# EAGLE schematic protoBot (EAGLE 6.3)

## Sheet 1 of 5
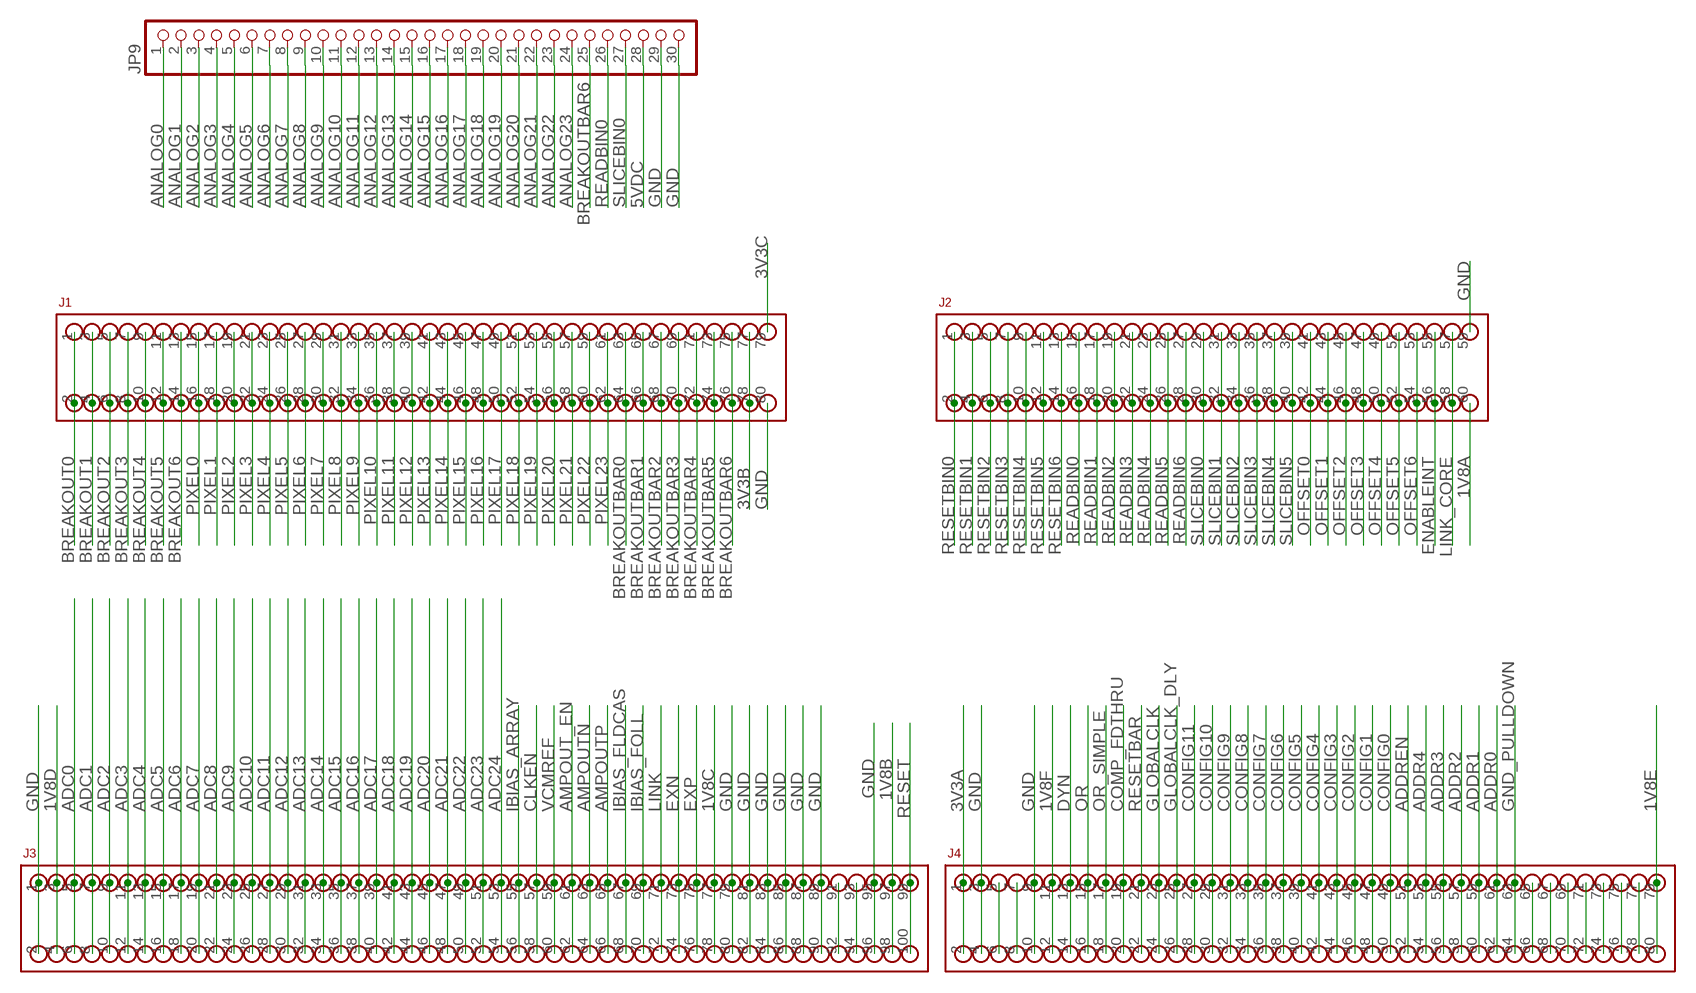
[diagram p0: schematic, sheet 1]

### Parts
J1  AMPMODU50-80  [AMPMODU50-80]
J2  AMPMODU50-60  [AMPMODU50-60]
J3  AMPMODU50-100  [AMPMODU50-100]
J4  AMPMODU50-80  [AMPMODU50-80]
JP9  PINHD-1X30  [1X30]

### Nets
1V8A: J2.60 ; also sheet 4,5
1V8B: J3.97 J3.98 ; also sheet 4,5
1V8C: J3.77 J3.78 ; also sheet 4,5
1V8D: J3.3 J3.4 ; also sheet 5
1V8E: J4.79 J4.80 ; also sheet 5
1V8F: J4.11 J4.12 ; also sheet 5
3V3A: J4.1 J4.2 ; also sheet 5
3V3B: J1.77 J1.78 ; also sheet 5
3V3C: J1.79 ; also sheet 3,5
5VDC: JP9.28 ; also sheet 2,5
ADC0: J3.5 J3.6 ; also sheet 4
ADC1: J3.7 J3.8 ; also sheet 4
ADC2: J3.9 J3.10 ; also sheet 4
ADC3: J3.11 J3.12 ; also sheet 4
ADC4: J3.13 J3.14 ; also sheet 4
ADC5: J3.15 J3.16 ; also sheet 4
ADC6: J3.17 J3.18 ; also sheet 4
ADC7: J3.19 J3.20 ; also sheet 4
ADC8: J3.21 J3.22 ; also sheet 4
ADC9: J3.23 J3.24 ; also sheet 4
ADC10: J3.25 J3.26 ; also sheet 4
ADC11: J3.27 J3.28 ; also sheet 4
ADC12: J3.29 J3.30 ; also sheet 4
ADC13: J3.31 J3.32 ; also sheet 4
ADC14: J3.33 J3.34 ; also sheet 4
ADC15: J3.35 J3.36 ; also sheet 4
ADC16: J3.37 J3.38 ; also sheet 4
ADC17: J3.39 J3.40 ; also sheet 4
ADC18: J3.41 J3.42 ; also sheet 4
ADC19: J3.43 J3.44 ; also sheet 4
ADC20: J3.45 J3.46 ; also sheet 4
ADC21: J3.47 J3.48 ; also sheet 4
ADC22: J3.49 J3.50 ; also sheet 4
ADC23: J3.51 J3.52 ; also sheet 4
ADC24: J3.53 J3.54 ; also sheet 4
ADDR0: J4.61 J4.62 ; also sheet 4
ADDR1: J4.59 J4.60 ; also sheet 4
ADDR2: J4.57 J4.58 ; also sheet 4
ADDR3: J4.55 J4.56 ; also sheet 4
ADDR4: J4.53 J4.54 ; also sheet 4
ADDREN: J4.51 J4.52 ; also sheet 4
AMPOUT_EN: J3.61 J3.62 ; also sheet 4
AMPOUTN: J3.63 J3.64 ; also sheet 4
AMPOUTP: J3.65 J3.66 ; also sheet 4
ANALOG0: JP9.1 ; also sheet 2
ANALOG1: JP9.2 ; also sheet 2
ANALOG2: JP9.3 ; also sheet 2
ANALOG3: JP9.4 ; also sheet 2
ANALOG4: JP9.5 ; also sheet 2
ANALOG5: JP9.6 ; also sheet 2
ANALOG6: JP9.7 ; also sheet 2
ANALOG7: JP9.8 ; also sheet 2
ANALOG8: JP9.9 ; also sheet 2
ANALOG9: JP9.10 ; also sheet 2
ANALOG10: JP9.11 ; also sheet 2
ANALOG11: JP9.12 ; also sheet 2
ANALOG12: JP9.13 ; also sheet 2
ANALOG13: JP9.14 ; also sheet 2
ANALOG14: JP9.15 ; also sheet 2
ANALOG15: JP9.16 ; also sheet 2
ANALOG16: JP9.17 ; also sheet 2
ANALOG17: JP9.18 ; also sheet 2
ANALOG18: JP9.19 ; also sheet 2
ANALOG19: JP9.20 ; also sheet 2
ANALOG20: JP9.21 ; also sheet 2
ANALOG21: JP9.22 ; also sheet 2
ANALOG22: JP9.23 ; also sheet 2
ANALOG23: JP9.24 ; also sheet 2
BREAKOUT0: J1.1 J1.2 ; also sheet 3
BREAKOUT1: J1.3 J1.4 ; also sheet 3
BREAKOUT2: J1.5 J1.6 ; also sheet 3
BREAKOUT3: J1.7 J1.8 ; also sheet 3
BREAKOUT4: J1.9 J1.10 ; also sheet 3
BREAKOUT5: J1.11 J1.12 ; also sheet 3
BREAKOUT6: J1.13 J1.14 ; also sheet 3
BREAKOUTBAR0: J1.63 J1.64 ; also sheet 3
BREAKOUTBAR1: J1.65 J1.66 ; also sheet 3
BREAKOUTBAR2: J1.67 J1.68 ; also sheet 3
BREAKOUTBAR3: J1.69 J1.70 ; also sheet 3
BREAKOUTBAR4: J1.71 J1.72 ; also sheet 3
BREAKOUTBAR5: J1.73 J1.74 ; also sheet 3
BREAKOUTBAR6: J1.75 J1.76 JP9.25 ; also sheet 3
CLKEN: J3.57 J3.58 ; also sheet 4
COMP_FDTHRU: J4.19 J4.20 ; also sheet 4
CONFIG0: J4.49 J4.50 ; also sheet 4
CONFIG1: J4.47 J4.48 ; also sheet 4
CONFIG2: J4.45 J4.46 ; also sheet 4
CONFIG3: J4.43 J4.44 ; also sheet 4
CONFIG4: J4.41 J4.42 ; also sheet 4
CONFIG5: J4.39 J4.40 ; also sheet 4
CONFIG6: J4.37 J4.38 ; also sheet 4
CONFIG7: J4.35 J4.36 ; also sheet 4
CONFIG8: J4.33 J4.34 ; also sheet 4
CONFIG9: J4.31 J4.32 ; also sheet 4
CONFIG10: J4.29 J4.30 ; also sheet 4
CONFIG11: J4.27 J4.28 ; also sheet 4
DYN: J4.13 J4.14
ENABLEINT: J2.55 J2.56 ; also sheet 4
EXN: J3.73 J3.74 ; also sheet 4
EXP: J3.75 J3.76 ; also sheet 4
GLOBALCLK: J4.23 J4.24
GLOBALCLK_DLY: J4.25 J4.26
GND: J1.80 J2.59 J3.1 J3.2 J3.79 J3.80 J3.81 J3.82 J3.83 J3.84 J3.85 J3.86 J3.87 J3.88 J3.89 J3.90 J3.95 J3.96 J4.3 J4.4 J4.9 J4.10 JP9.29 JP9.30 ; also sheet 2,3,4,5
GND_PULLDOWN: J4.63 J4.64 ; also sheet 4
IBIAS_ARRAY: J3.55 J3.56 ; also sheet 4
IBIAS_FLDCAS: J3.67 J3.68 ; also sheet 4
IBIAS_FOLL: J3.69 J3.70 ; also sheet 4
LINK: J3.71 J3.72 ; also sheet 4
LINK_CORE: J2.57 J2.58 ; also sheet 4
N$2: J4.5 J4.6
N$5: J4.7 J4.8
N$19: J4.65 J4.66
N$20: J4.67 J4.68
N$21: J4.69 J4.70
N$22: J4.71 J4.72
N$23: J4.73 J4.74
N$24: J4.75 J4.76
N$25: J4.77 J4.78
N$30: J3.91 J3.92
N$31: J3.93 J3.94
OFFSET0: J2.41 J2.42 ; also sheet 4
OFFSET1: J2.43 J2.44 ; also sheet 4
OFFSET2: J2.45 J2.46 ; also sheet 4
OFFSET3: J2.47 J2.48 ; also sheet 4
OFFSET4: J2.49 J2.50 ; also sheet 4
OFFSET5: J2.51 J2.52 ; also sheet 4
OFFSET6: J2.53 J2.54 ; also sheet 4
OR: J4.15 J4.16 ; also sheet 4
OR_SIMPLE: J4.17 J4.18 ; also sheet 4
PIXEL0: J1.15 J1.16 ; also sheet 2
PIXEL1: J1.17 J1.18 ; also sheet 2
PIXEL2: J1.19 J1.20 ; also sheet 2
PIXEL3: J1.21 J1.22 ; also sheet 2
PIXEL4: J1.23 J1.24 ; also sheet 2
PIXEL5: J1.25 J1.26 ; also sheet 2
PIXEL6: J1.27 J1.28 ; also sheet 2
PIXEL7: J1.29 J1.30 ; also sheet 2
PIXEL8: J1.31 J1.32 ; also sheet 2
PIXEL9: J1.33 J1.34 ; also sheet 2
PIXEL10: J1.35 J1.36 ; also sheet 2
PIXEL11: J1.37 J1.38 ; also sheet 2
PIXEL12: J1.39 J1.40 ; also sheet 2
PIXEL13: J1.41 J1.42 ; also sheet 2
PIXEL14: J1.43 J1.44 ; also sheet 2
PIXEL15: J1.45 J1.46 ; also sheet 2
PIXEL16: J1.47 J1.48 ; also sheet 2
PIXEL17: J1.49 J1.50 ; also sheet 2
PIXEL18: J1.51 J1.52 ; also sheet 2
PIXEL19: J1.53 J1.54 ; also sheet 2
PIXEL20: J1.55 J1.56 ; also sheet 2
PIXEL21: J1.57 J1.58 ; also sheet 2
PIXEL22: J1.59 J1.60 ; also sheet 2
PIXEL23: J1.61 J1.62 ; also sheet 2
READBIN0: J2.15 J2.16 JP9.26 ; also sheet 3
READBIN1: J2.17 J2.18
READBIN2: J2.19 J2.20
READBIN3: J2.21 J2.22
READBIN4: J2.23 J2.24
READBIN5: J2.25 J2.26
READBIN6: J2.27 J2.28 ; also sheet 3
RESET: J3.99 J3.100 ; also sheet 4
RESETBAR: J4.21 J4.22
RESETBIN0: J2.1 J2.2
RESETBIN1: J2.3 J2.4
RESETBIN2: J2.5 J2.6
RESETBIN3: J2.7 J2.8
RESETBIN4: J2.9 J2.10
RESETBIN5: J2.11 J2.12
RESETBIN6: J2.13 J2.14
SLICEBIN0: J2.29 J2.30 JP9.27 ; also sheet 3
SLICEBIN1: J2.31 J2.32 ; also sheet 3
SLICEBIN2: J2.33 J2.34 ; also sheet 3
SLICEBIN3: J2.35 J2.36 ; also sheet 3
SLICEBIN4: J2.37 J2.38 ; also sheet 3
SLICEBIN5: J2.39 J2.40 ; also sheet 3
VCMREF: J3.59 J3.60 ; also sheet 4

## Sheet 2 of 5
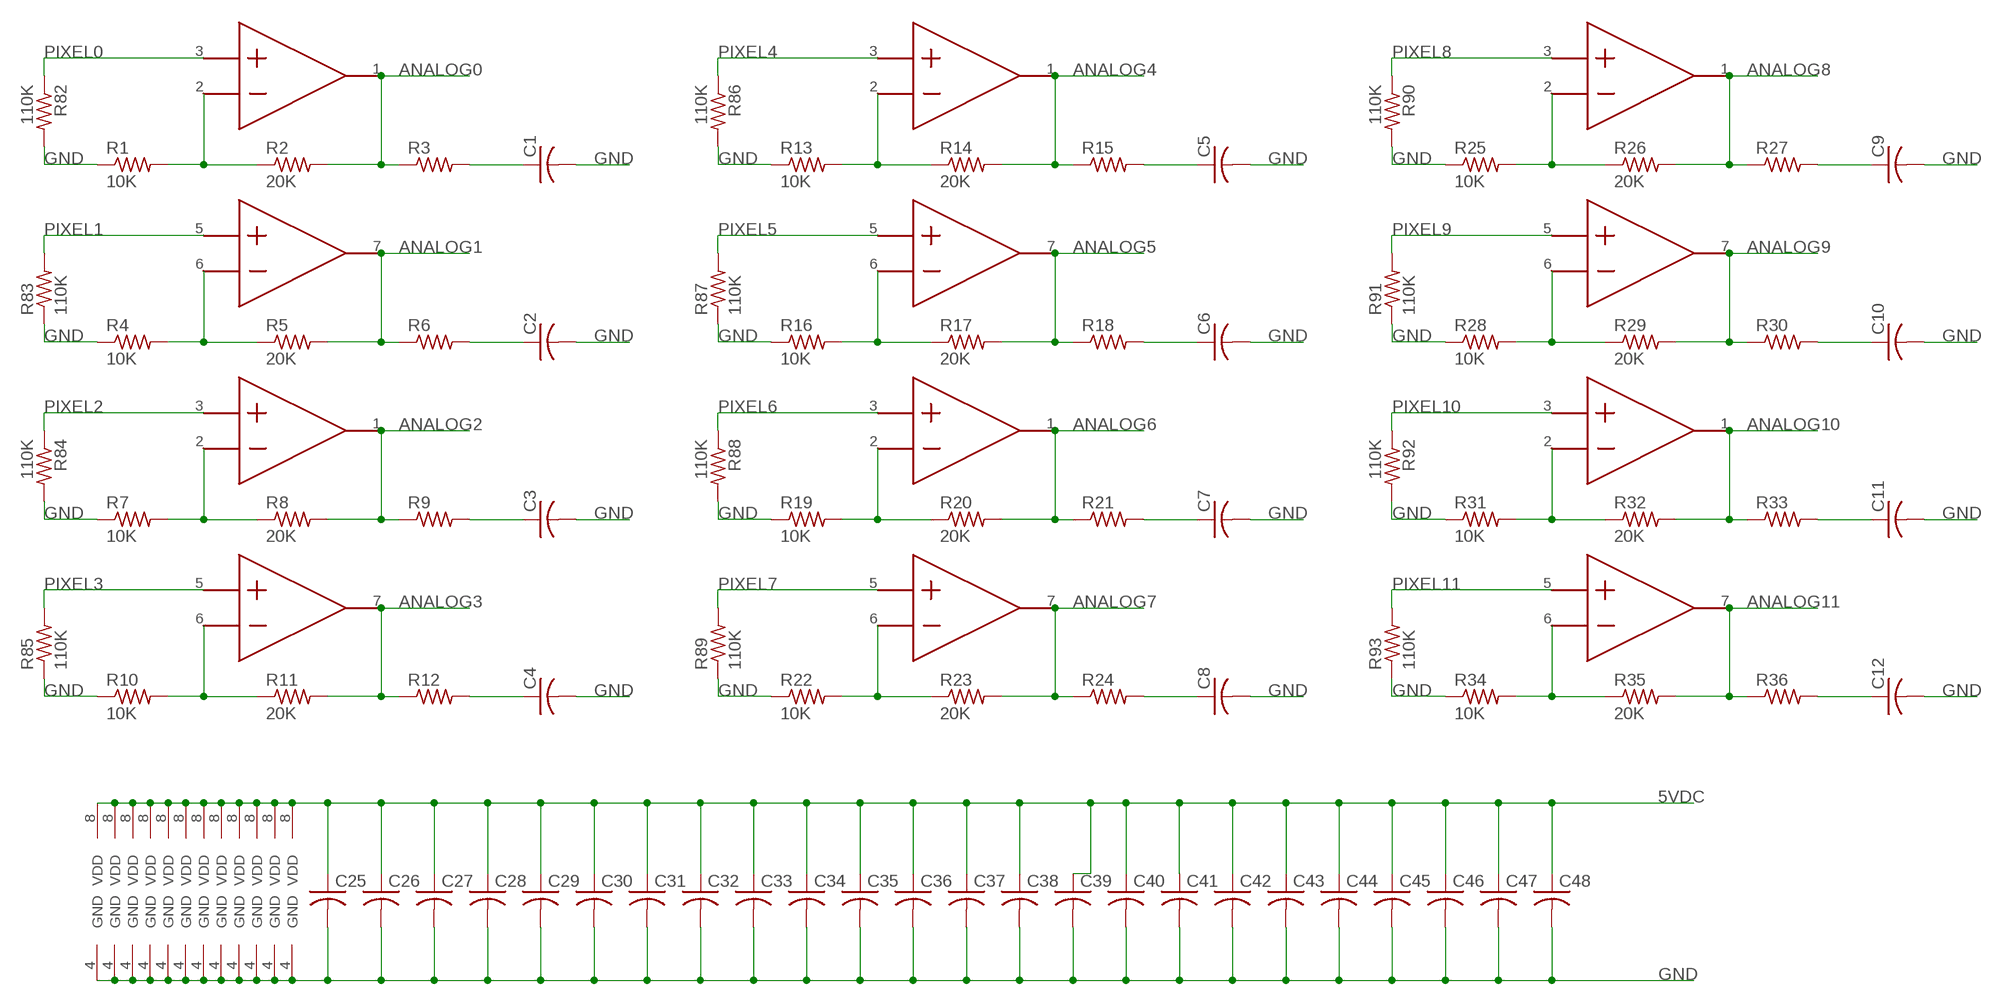
[diagram p1: schematic, sheet 2, part 1 of 2]
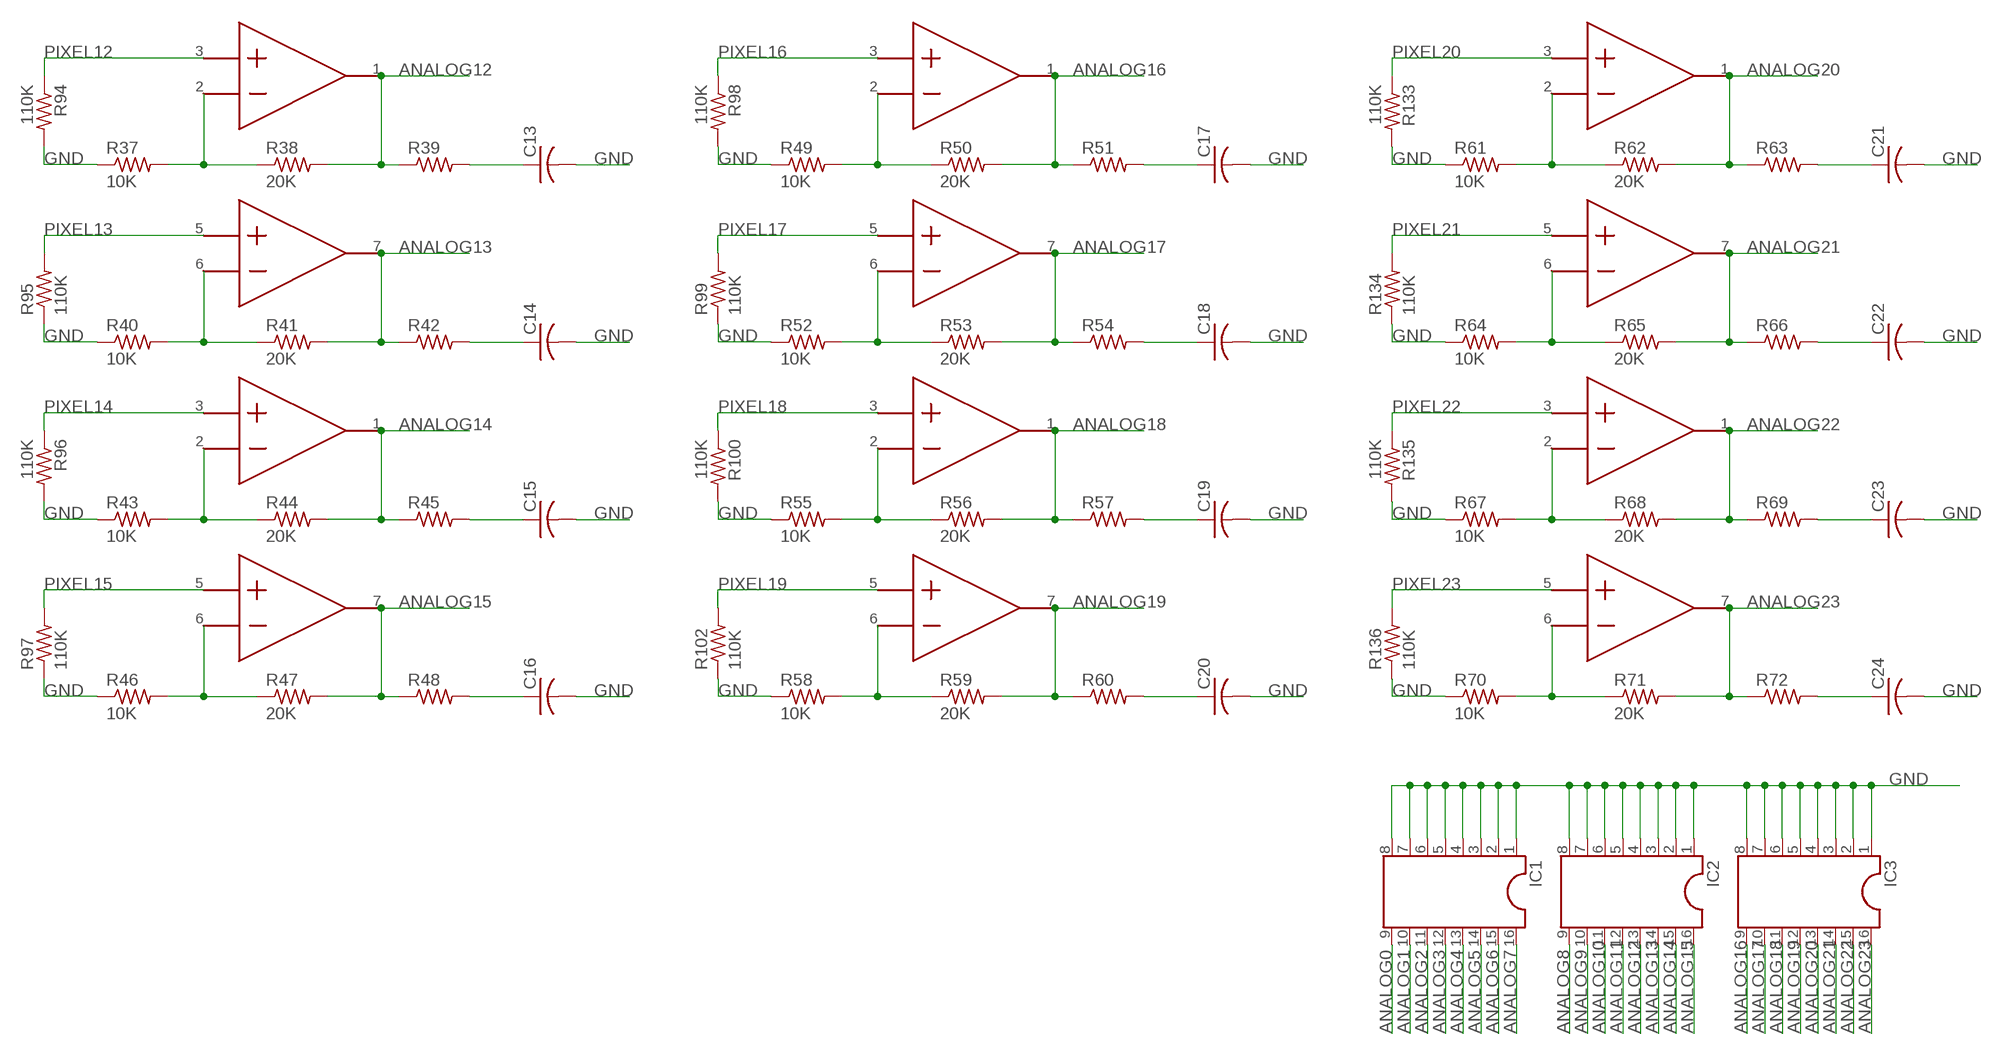
[diagram p2: schematic, sheet 2, part 2 of 2]

### Parts
C1  C-USC0603  [C0603]
C2  C-USC0603  [C0603]
C3  C-USC0603  [C0603]
C4  C-USC0603  [C0603]
C5  C-USC0603  [C0603]
C6  C-USC0603  [C0603]
C7  C-USC0603  [C0603]
C8  C-USC0603  [C0603]
C9  C-USC0603  [C0603]
C10  C-USC0603  [C0603]
C11  C-USC0603  [C0603]
C12  C-USC0603  [C0603]
C13  C-USC0603  [C0603]
C14  C-USC0603  [C0603]
C15  C-USC0603  [C0603]
C16  C-USC0603  [C0603]
C17  C-USC0603  [C0603]
C18  C-USC0603  [C0603]
C19  C-USC0603  [C0603]
C20  C-USC0603  [C0603]
C21  C-USC0603  [C0603]
C22  C-USC0603  [C0603]
C23  C-USC0603  [C0603]
C24  C-USC0603  [C0603]
C25  C-USC0603  [C0603]
C26  C-USC0603  [C0603]
C27  C-USC0603  [C0603]
C28  C-USC0603  [C0603]
C29  C-USC0603  [C0603]
C30  C-USC0603  [C0603]
C31  C-USC0603  [C0603]
C32  C-USC0603  [C0603]
C33  C-USC0603  [C0603]
C34  C-USC0603  [C0603]
C35  C-USC0603  [C0603]
C36  C-USC0603  [C0603]
C37  C-USC0603  [C0603]
C38  C-USC0603  [C0603]
C39  C-USC0603  [C0603]
C40  C-USC0603  [C0603]
C41  C-USC0603  [C0603]
C42  C-USC0603  [C0603]
C43  C-USC0603  [C0603]
C44  C-USC0603  [C0603]
C45  C-USC0603  [C0603]
C46  C-USC0603  [C0603]
C47  C-USC0603  [C0603]
C48  C-USC0603  [C0603]
IC1  DIL16S  [SOCKET-16]
IC2  DIL16S  [SOCKET-16]
IC3  DIL16S  [SOCKET-16]
R1  10K  R-US_R0603  [R0603]
R2  20K  R-US_R0603  [R0603]
R3  R-US_R0603  [R0603]
R4  10K  R-US_R0603  [R0603]
R5  20K  R-US_R0603  [R0603]
R6  R-US_R0603  [R0603]
R7  10K  R-US_R0603  [R0603]
R8  20K  R-US_R0603  [R0603]
R9  R-US_R0603  [R0603]
R10  10K  R-US_R0603  [R0603]
R11  20K  R-US_R0603  [R0603]
R12  R-US_R0603  [R0603]
R13  10K  R-US_R0603  [R0603]
R14  20K  R-US_R0603  [R0603]
R15  R-US_R0603  [R0603]
R16  10K  R-US_R0603  [R0603]
R17  20K  R-US_R0603  [R0603]
R18  R-US_R0603  [R0603]
R19  10K  R-US_R0603  [R0603]
R20  20K  R-US_R0603  [R0603]
R21  R-US_R0603  [R0603]
R22  10K  R-US_R0603  [R0603]
R23  20K  R-US_R0603  [R0603]
R24  R-US_R0603  [R0603]
R25  10K  R-US_R0603  [R0603]
R26  20K  R-US_R0603  [R0603]
R27  R-US_R0603  [R0603]
R28  10K  R-US_R0603  [R0603]
R29  20K  R-US_R0603  [R0603]
R30  R-US_R0603  [R0603]
R31  10K  R-US_R0603  [R0603]
R32  20K  R-US_R0603  [R0603]
R33  R-US_R0603  [R0603]
R34  10K  R-US_R0603  [R0603]
R35  20K  R-US_R0603  [R0603]
R36  R-US_R0603  [R0603]
R37  10K  R-US_R0603  [R0603]
R38  20K  R-US_R0603  [R0603]
R39  R-US_R0603  [R0603]
R40  10K  R-US_R0603  [R0603]
R41  20K  R-US_R0603  [R0603]
R42  R-US_R0603  [R0603]
R43  10K  R-US_R0603  [R0603]
R44  20K  R-US_R0603  [R0603]
R45  R-US_R0603  [R0603]
R46  10K  R-US_R0603  [R0603]
R47  20K  R-US_R0603  [R0603]
R48  R-US_R0603  [R0603]
R49  10K  R-US_R0603  [R0603]
R50  20K  R-US_R0603  [R0603]
R51  R-US_R0603  [R0603]
R52  10K  R-US_R0603  [R0603]
R53  20K  R-US_R0603  [R0603]
R54  R-US_R0603  [R0603]
R55  10K  R-US_R0603  [R0603]
R56  20K  R-US_R0603  [R0603]
R57  R-US_R0603  [R0603]
R58  10K  R-US_R0603  [R0603]
R59  20K  R-US_R0603  [R0603]
R60  R-US_R0603  [R0603]
R61  10K  R-US_R0603  [R0603]
R62  20K  R-US_R0603  [R0603]
R63  R-US_R0603  [R0603]
R64  10K  R-US_R0603  [R0603]
R65  20K  R-US_R0603  [R0603]
R66  R-US_R0603  [R0603]
R67  10K  R-US_R0603  [R0603]
R68  20K  R-US_R0603  [R0603]
R69  R-US_R0603  [R0603]
R70  10K  R-US_R0603  [R0603]
R71  20K  R-US_R0603  [R0603]
R72  R-US_R0603  [R0603]
R82  110K  R-US_R0603  [R0603]
R83  110K  R-US_R0603  [R0603]
R84  110K  R-US_R0603  [R0603]
R85  110K  R-US_R0603  [R0603]
R86  110K  R-US_R0603  [R0603]
R87  110K  R-US_R0603  [R0603]
R88  110K  R-US_R0603  [R0603]
R89  110K  R-US_R0603  [R0603]
R90  110K  R-US_R0603  [R0603]
R91  110K  R-US_R0603  [R0603]
R92  110K  R-US_R0603  [R0603]
R93  110K  R-US_R0603  [R0603]
R94  110K  R-US_R0603  [R0603]
R95  110K  R-US_R0603  [R0603]
R96  110K  R-US_R0603  [R0603]
R97  110K  R-US_R0603  [R0603]
R98  110K  R-US_R0603  [R0603]
R99  110K  R-US_R0603  [R0603]
R100  110K  R-US_R0603  [R0603]
R102  110K  R-US_R0603  [R0603]
R133  110K  R-US_R0603  [R0603]
R134  110K  R-US_R0603  [R0603]
R135  110K  R-US_R0603  [R0603]
R136  110K  R-US_R0603  [R0603]
U$1  AD823  [SOIC-8]
U$2  AD823  [SOIC-8]
U$3  AD823  [SOIC-8]
U$4  AD823  [SOIC-8]
U$5  AD823  [SOIC-8]
U$6  AD823  [SOIC-8]
U$7  AD823  [SOIC-8]
U$8  AD823  [SOIC-8]
U$9  AD823  [SOIC-8]
U$10  AD823  [SOIC-8]
U$11  AD823  [SOIC-8]
U$12  AD823  [SOIC-8]

### Nets
5VDC: C25.1 C26.1 C27.1 C28.1 C29.1 C30.1 C31.1 C32.1 C33.1 C34.1 C35.1 C36.1 C37.1 C38.1 C39.1 C40.1 C41.1 C42.1 C43.1 C44.1 C45.1 C46.1 C47.1 C48.1 U$1.8(VDD) U$2.8(VDD) U$3.8(VDD) U$4.8(VDD) U$5.8(VDD) U$6.8(VDD) U$7.8(VDD) U$8.8(VDD) U$9.8(VDD) U$10.8(VDD) U$11.8(VDD) U$12.8(VDD) ; also sheet 1,5
ANALOG0: IC1.9 R2.2 R3.1 U$1.1(OUT) ; also sheet 1
ANALOG1: IC1.10 R5.2 R6.1 U$1.7(OUT) ; also sheet 1
ANALOG2: IC1.11 R8.2 R9.1 U$2.1(OUT) ; also sheet 1
ANALOG3: IC1.12 R11.2 R12.1 U$2.7(OUT) ; also sheet 1
ANALOG4: IC1.13 R14.2 R15.1 U$3.1(OUT) ; also sheet 1
ANALOG5: IC1.14 R17.2 R18.1 U$3.7(OUT) ; also sheet 1
ANALOG6: IC1.15 R20.2 R21.1 U$4.1(OUT) ; also sheet 1
ANALOG7: IC1.16 R23.2 R24.1 U$4.7(OUT) ; also sheet 1
ANALOG8: IC2.9 R26.2 R27.1 U$5.1(OUT) ; also sheet 1
ANALOG9: IC2.10 R29.2 R30.1 U$5.7(OUT) ; also sheet 1
ANALOG10: IC2.11 R32.2 R33.1 U$6.1(OUT) ; also sheet 1
ANALOG11: IC2.12 R35.2 R36.1 U$6.7(OUT) ; also sheet 1
ANALOG12: IC2.13 R38.2 R39.1 U$7.1(OUT) ; also sheet 1
ANALOG13: IC2.14 R41.2 R42.1 U$7.7(OUT) ; also sheet 1
ANALOG14: IC2.15 R44.2 R45.1 U$8.1(OUT) ; also sheet 1
ANALOG15: IC2.16 R47.2 R48.1 U$8.7(OUT) ; also sheet 1
ANALOG16: IC3.9 R50.2 R51.1 U$9.1(OUT) ; also sheet 1
ANALOG17: IC3.10 R53.2 R54.1 U$9.7(OUT) ; also sheet 1
ANALOG18: IC3.11 R56.2 R57.1 U$10.1(OUT) ; also sheet 1
ANALOG19: IC3.12 R59.2 R60.1 U$10.7(OUT) ; also sheet 1
ANALOG20: IC3.13 R62.2 R63.1 U$11.1(OUT) ; also sheet 1
ANALOG21: IC3.14 R65.2 R66.1 U$11.7(OUT) ; also sheet 1
ANALOG22: IC3.15 R68.2 R69.1 U$12.1(OUT) ; also sheet 1
ANALOG23: IC3.16 R71.2 R72.1 U$12.7(OUT) ; also sheet 1
GND: C1.2 C2.2 C3.2 C4.2 C5.2 C6.2 C7.2 C8.2 C9.2 C10.2 C11.2 C12.2 C13.2 C14.2 C15.2 C16.2 C17.2 C18.2 C19.2 C20.2 C21.2 C22.2 C23.2 C24.2 C25.2 C26.2 C27.2 C28.2 C29.2 C30.2 C31.2 C32.2 C33.2 C34.2 C35.2 C36.2 C37.2 C38.2 C39.2 C40.2 C41.2 C42.2 C43.2 C44.2 C45.2 C46.2 C47.2 C48.2 IC1.1 IC1.2 IC1.3 IC1.4 IC1.5 IC1.6 IC1.7 IC1.8 IC2.1 IC2.2 IC2.3 IC2.4 IC2.5 IC2.6 IC2.7 IC2.8 IC3.1 IC3.2 IC3.3 IC3.4 IC3.5 IC3.6 IC3.7 IC3.8 R1.1 R4.1 R7.1 R10.1 R13.1 R16.1 R19.1 R22.1 R25.1 R28.1 R31.1 R34.1 R37.1 R40.1 R43.1 R46.1 R49.1 R52.1 R55.1 R58.1 R61.1 R64.1 R67.1 R70.1 R82.2 R83.1 R84.2 R85.1 R86.2 R87.1 R88.2 R89.1 R90.2 R91.1 R92.2 R93.1 R94.2 R95.1 R96.2 R97.1 R98.2 R99.1 R100.2 R102.1 R133.2 R134.1 R135.2 R136.1 U$1.4(GND) U$2.4(GND) U$3.4(GND) U$4.4(GND) U$5.4(GND) U$6.4(GND) U$7.4(GND) U$8.4(GND) U$9.4(GND) U$10.4(GND) U$11.4(GND) U$12.4(GND) ; also sheet 1,3,4,5
N$1: R1.2 R2.1 U$1.2(IN-)
N$4: C1.1 R3.2
N$6: R13.2 R14.1 U$3.2(IN-)
N$8: C5.1 R15.2
N$9: R4.2 R5.1 U$1.6(IN-)
N$11: C2.1 R6.2
N$12: R16.2 R17.1 U$3.6(IN-)
N$14: R7.2 R8.1 U$2.2(IN-)
N$16: C3.1 R9.2
N$17: C6.1 R18.2
N$18: R19.2 R20.1 U$4.2(IN-)
N$26: R10.2 R11.1 U$2.6(IN-)
N$28: C4.1 R12.2
N$32: C7.1 R21.2
N$33: R22.2 R23.1 U$4.6(IN-)
N$35: C8.1 R24.2
N$36: R25.2 R26.1 U$5.2(IN-)
N$38: C9.1 R27.2
N$39: R28.2 R29.1 U$5.6(IN-)
N$41: C10.1 R30.2
N$42: R31.2 R32.1 U$6.2(IN-)
N$44: C11.1 R33.2
N$45: R34.2 R35.1 U$6.6(IN-)
N$47: C12.1 R36.2
N$48: R37.2 R38.1 U$7.2(IN-)
N$50: C13.1 R39.2
N$51: R40.2 R41.1 U$7.6(IN-)
N$53: C14.1 R42.2
N$54: R43.2 R44.1 U$8.2(IN-)
N$56: C15.1 R45.2
N$57: R46.2 R47.1 U$8.6(IN-)
N$59: C16.1 R48.2
N$60: R49.2 R50.1 U$9.2(IN-)
N$62: C17.1 R51.2
N$63: R52.2 R53.1 U$9.6(IN-)
N$65: C18.1 R54.2
N$66: R55.2 R56.1 U$10.2(IN-)
N$68: C19.1 R57.2
N$69: R58.2 R59.1 U$10.6(IN-)
N$71: C20.1 R60.2
N$72: R61.2 R62.1 U$11.2(IN-)
N$74: C21.1 R63.2
N$75: R64.2 R65.1 U$11.6(IN-)
N$77: C22.1 R66.2
N$78: R67.2 R68.1 U$12.2(IN-)
N$80: C23.1 R69.2
N$81: R70.2 R71.1 U$12.6(IN-)
N$83: C24.1 R72.2
PIXEL0: R82.1 U$1.3(IN+) ; also sheet 1
PIXEL1: R83.2 U$1.5(IN+) ; also sheet 1
PIXEL2: R84.1 U$2.3(IN+) ; also sheet 1
PIXEL3: R85.2 U$2.5(IN+) ; also sheet 1
PIXEL4: R86.1 U$3.3(IN+) ; also sheet 1
PIXEL5: R87.2 U$3.5(IN+) ; also sheet 1
PIXEL6: R88.1 U$4.3(IN+) ; also sheet 1
PIXEL7: R89.2 U$4.5(IN+) ; also sheet 1
PIXEL8: R90.1 U$5.3(IN+) ; also sheet 1
PIXEL9: R91.2 U$5.5(IN+) ; also sheet 1
PIXEL10: R92.1 U$6.3(IN+) ; also sheet 1
PIXEL11: R93.2 U$6.5(IN+) ; also sheet 1
PIXEL12: R94.1 U$7.3(IN+) ; also sheet 1
PIXEL13: R95.2 U$7.5(IN+) ; also sheet 1
PIXEL14: R96.1 U$8.3(IN+) ; also sheet 1
PIXEL15: R97.2 U$8.5(IN+) ; also sheet 1
PIXEL16: R98.1 U$9.3(IN+) ; also sheet 1
PIXEL17: R99.2 U$9.5(IN+) ; also sheet 1
PIXEL18: R100.1 U$10.3(IN+) ; also sheet 1
PIXEL19: R102.2 U$10.5(IN+) ; also sheet 1
PIXEL20: R133.1 U$11.3(IN+) ; also sheet 1
PIXEL21: R134.2 U$11.5(IN+) ; also sheet 1
PIXEL22: R135.1 U$12.3(IN+) ; also sheet 1
PIXEL23: R136.2 U$12.5(IN+) ; also sheet 1

## Sheet 3 of 5
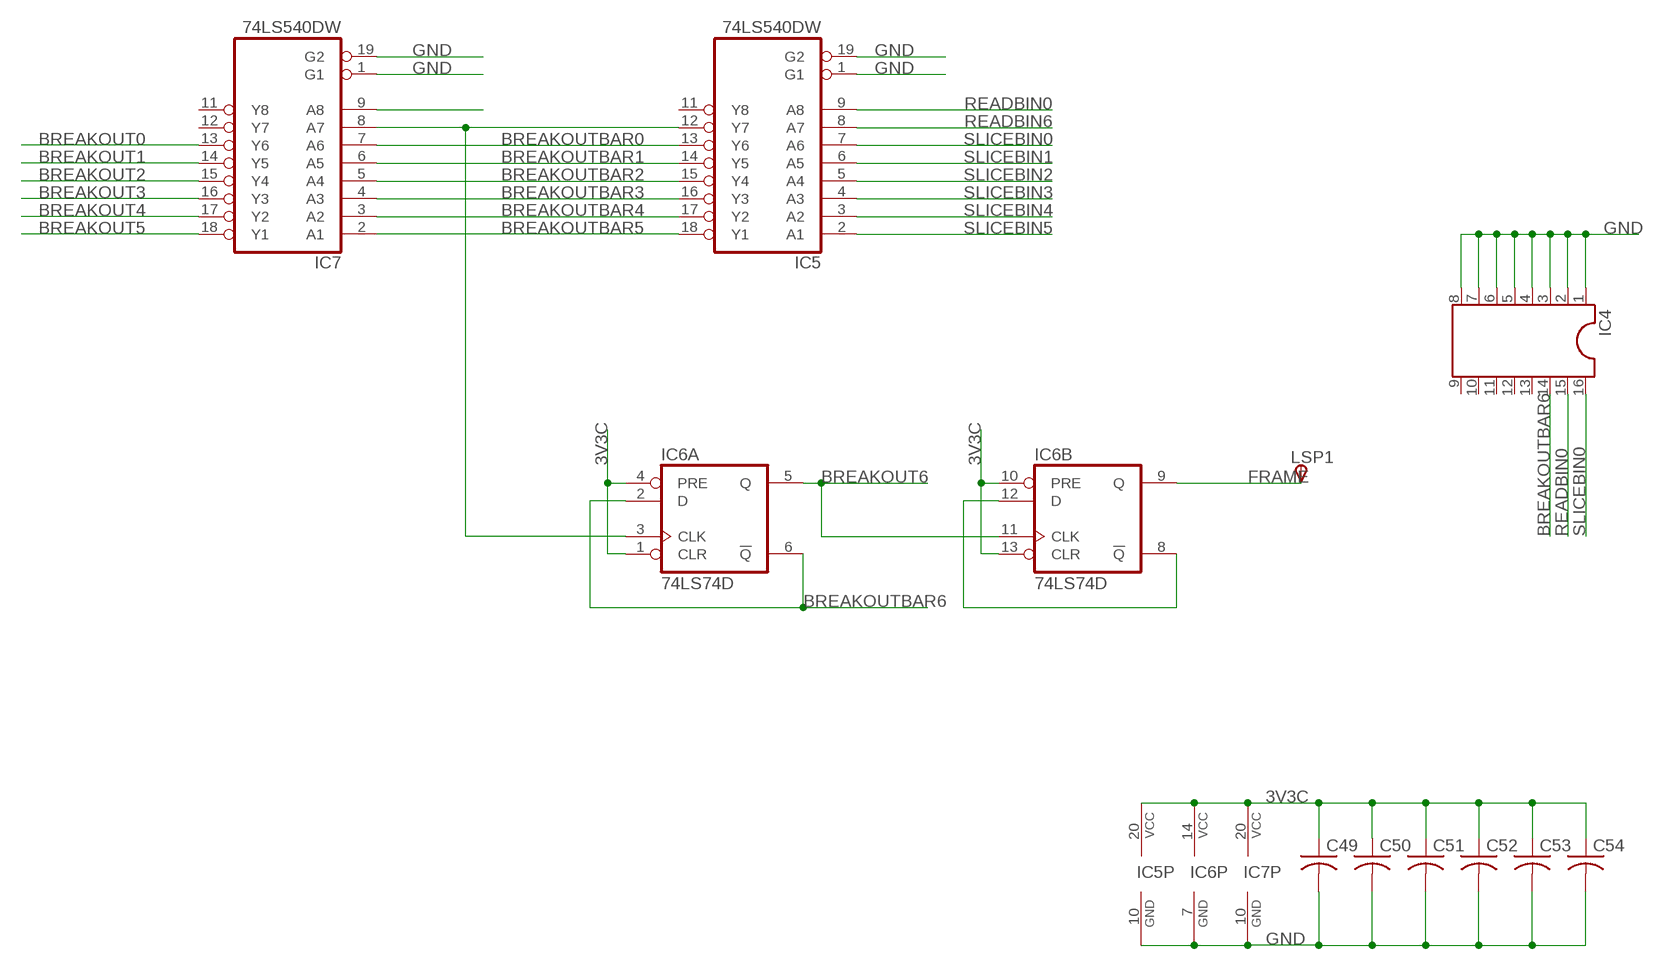
[diagram p3: schematic, sheet 3]

### Parts
C49  C-USC0603  [C0603]
C50  C-USC0603  [C0603]
C51  C-USC0603  [C0603]
C52  C-USC0603  [C0603]
C53  C-USC0603  [C0603]
C54  C-USC0603  [C0603]
IC4  DIL16S  [SOCKET-16]
IC5  74LS540DW  [SO20W]
IC6  74LS74D  [SO14]
IC7  74LS540DW  [SO20W]
LSP1  TPSPAD1-13  [P1-13]

### Nets
3V3C: C49.1 C50.1 C51.1 C52.1 C53.1 C54.1 IC5.20(VCC) IC6.1(A:CLR) IC6.4(A:PRE) IC6.10(B:PRE) IC6.13(B:CLR) IC6.14(P:VCC) IC7.20(VCC) ; also sheet 1,5
BREAKOUT0: IC7.13(Y6) ; also sheet 1
BREAKOUT1: IC7.14(Y5) ; also sheet 1
BREAKOUT2: IC7.15(Y4) ; also sheet 1
BREAKOUT3: IC7.16(Y3) ; also sheet 1
BREAKOUT4: IC7.17(Y2) ; also sheet 1
BREAKOUT5: IC7.18(Y1) ; also sheet 1
BREAKOUT6: IC6.5(A:Q) IC6.11(B:CLK) ; also sheet 1
BREAKOUTBAR0: IC5.13(Y6) IC7.7(A6) ; also sheet 1
BREAKOUTBAR1: IC5.14(Y5) IC7.6(A5) ; also sheet 1
BREAKOUTBAR2: IC5.15(Y4) IC7.5(A4) ; also sheet 1
BREAKOUTBAR3: IC5.16(Y3) IC7.4(A3) ; also sheet 1
BREAKOUTBAR4: IC5.17(Y2) IC7.3(A2) ; also sheet 1
BREAKOUTBAR5: IC5.18(Y1) IC7.2(A1) ; also sheet 1
BREAKOUTBAR6: IC4.14 IC6.2(A:D) IC6.6(A:!Q) ; also sheet 1
FRAME: IC6.9(B:Q) LSP1.1(PP)
GND: C49.2 C50.2 C51.2 C52.2 C53.2 C54.2 IC4.1 IC4.2 IC4.3 IC4.4 IC4.5 IC4.6 IC4.7 IC4.8 IC5.1(G1) IC5.10(GND) IC5.19(G2) IC6.7(P:GND) IC7.1(G1) IC7.9(A8) IC7.10(GND) IC7.19(G2) ; also sheet 1,2,4,5
N$15: IC5.12(Y7) IC6.3(A:CLK) IC7.8(A7)
N$37: IC6.8(B:!Q) IC6.12(B:D)
READBIN0: IC4.15 IC5.9(A8) ; also sheet 1
READBIN6: IC5.8(A7) ; also sheet 1
SLICEBIN0: IC4.16 IC5.7(A6) ; also sheet 1
SLICEBIN1: IC5.6(A5) ; also sheet 1
SLICEBIN2: IC5.5(A4) ; also sheet 1
SLICEBIN3: IC5.4(A3) ; also sheet 1
SLICEBIN4: IC5.3(A2) ; also sheet 1
SLICEBIN5: IC5.2(A1) ; also sheet 1
Unconnected: IC4.9 IC4.10 IC4.11 IC4.12 IC4.13 IC5.11(Y8) IC7.11(Y8) IC7.12(Y7)

## Sheet 4 of 5
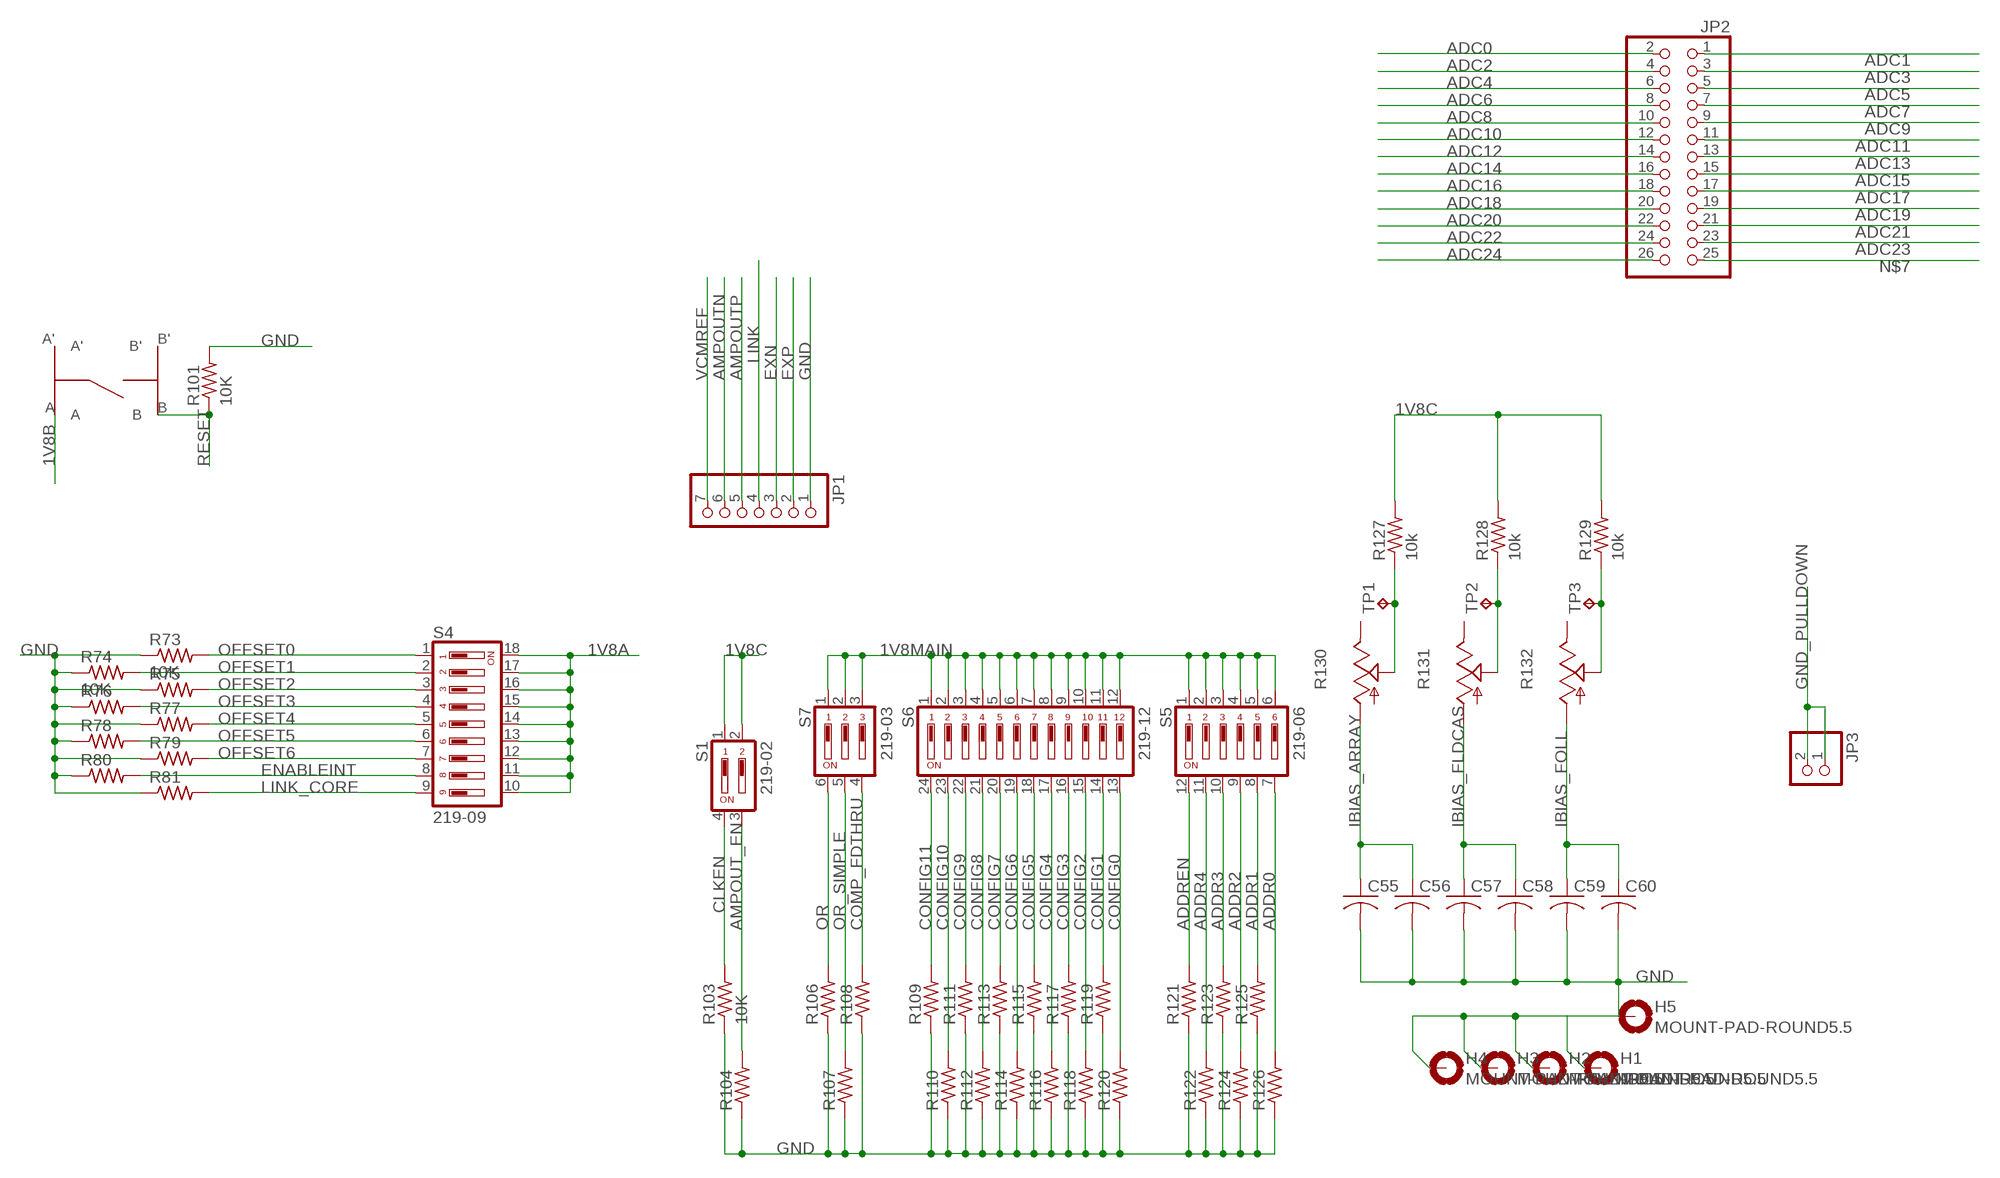
[diagram p4: schematic, sheet 4]

### Parts
C55  C-USC1210  [C1210]
C56  C-USC0603  [C0603]
C57  C-USC1210  [C1210]
C58  C-USC0603  [C0603]
C59  C-USC1210  [C1210]
C60  C-USC0603  [C0603]
H1  MOUNT-PAD-ROUND5.5  [5,5-PAD]
H2  MOUNT-PAD-ROUND5.5  [5,5-PAD]
H3  MOUNT-PAD-ROUND5.5  [5,5-PAD]
H4  MOUNT-PAD-ROUND5.5  [5,5-PAD]
H5  MOUNT-PAD-ROUND5.5  [5,5-PAD]
JP1  PINHD-1X7  [1X07]
JP2  PINHD-2X13  [2X13]
JP3  PINHD-1X2  [1X02]
R73  10K  R-US_R0603  [R0603]
R74  10K  R-US_R0603  [R0603]
R75  R-US_R0603  [R0603]
R76  R-US_R0603  [R0603]
R77  R-US_R0603  [R0603]
R78  R-US_R0603  [R0603]
R79  R-US_R0603  [R0603]
R80  R-US_R0603  [R0603]
R81  R-US_R0603  [R0603]
R101  10K  R-US_R0603  [R0603]
R103  10K  R-US_R0603  [R0603]
R104  R-US_R0603  [R0603]
R106  R-US_R0603  [R0603]
R107  R-US_R0603  [R0603]
R108  R-US_R0603  [R0603]
R109  R-US_R0603  [R0603]
R110  R-US_R0603  [R0603]
R111  R-US_R0603  [R0603]
R112  R-US_R0603  [R0603]
R113  R-US_R0603  [R0603]
R114  R-US_R0603  [R0603]
R115  R-US_R0603  [R0603]
R116  R-US_R0603  [R0603]
R117  R-US_R0603  [R0603]
R118  R-US_R0603  [R0603]
R119  R-US_R0603  [R0603]
R120  R-US_R0603  [R0603]
R121  R-US_R0603  [R0603]
R122  R-US_R0603  [R0603]
R123  R-US_R0603  [R0603]
R124  R-US_R0603  [R0603]
R125  R-US_R0603  [R0603]
R126  R-US_R0603  [R0603]
R127  10k  R-US_R0603  [R0603]
R128  10k  R-US_R0603  [R0603]
R129  10k  R-US_R0603  [R0603]
R130  TRIM_US-B64Y  [B64Y]
R131  TRIM_US-B64Y  [B64Y]
R132  TRIM_US-B64Y  [B64Y]
S1  219-02  [CTS-219-02]
S2  EVQPA  [EVQPA]
S4  219-09  [CTS-219-09]
S5  219-06  [CTS-219-06]
S6  219-12  [CTS-219-12]
S7  219-03  [CTS-219-03]
TP1  TPTP20R  [TP20R]
TP2  TPTP20R  [TP20R]
TP3  TPTP20R  [TP20R]

### Nets
1V8A: S4.10 S4.11 S4.12 S4.13 S4.14 S4.15 S4.16 S4.17 S4.18 ; also sheet 1,5
1V8B: S2.A ; also sheet 1,5
1V8C: R127.2 R128.2 R129.2 S1.1 S1.2 ; also sheet 1,5
1V8MAIN: S5.1 S5.2 S5.3 S5.4 S5.5 S5.6 S6.1 S6.2 S6.3 S6.4 S6.5 S6.6 S6.7 S6.8 S6.9 S6.10 S6.11 S6.12 S7.1 S7.2 S7.3 ; also sheet 5
ADC0: JP2.2 ; also sheet 1
ADC1: JP2.1 ; also sheet 1
ADC2: JP2.4 ; also sheet 1
ADC3: JP2.3 ; also sheet 1
ADC4: JP2.6 ; also sheet 1
ADC5: JP2.5 ; also sheet 1
ADC6: JP2.8 ; also sheet 1
ADC7: JP2.7 ; also sheet 1
ADC8: JP2.10 ; also sheet 1
ADC9: JP2.9 ; also sheet 1
ADC10: JP2.12 ; also sheet 1
ADC11: JP2.11 ; also sheet 1
ADC12: JP2.14 ; also sheet 1
ADC13: JP2.13 ; also sheet 1
ADC14: JP2.16 ; also sheet 1
ADC15: JP2.15 ; also sheet 1
ADC16: JP2.18 ; also sheet 1
ADC17: JP2.17 ; also sheet 1
ADC18: JP2.20 ; also sheet 1
ADC19: JP2.19 ; also sheet 1
ADC20: JP2.22 ; also sheet 1
ADC21: JP2.21 ; also sheet 1
ADC22: JP2.24 ; also sheet 1
ADC23: JP2.23 ; also sheet 1
ADC24: JP2.26 ; also sheet 1
ADDR0: R126.2 S5.7 ; also sheet 1
ADDR1: R125.2 S5.8 ; also sheet 1
ADDR2: R124.2 S5.9 ; also sheet 1
ADDR3: R123.2 S5.10 ; also sheet 1
ADDR4: R122.2 S5.11 ; also sheet 1
ADDREN: R121.2 S5.12 ; also sheet 1
AMPOUT_EN: R104.2 S1.3 ; also sheet 1
AMPOUTN: JP1.6 ; also sheet 1
AMPOUTP: JP1.5 ; also sheet 1
CLKEN: R103.2 S1.4 ; also sheet 1
COMP_FDTHRU: R108.2 S7.4 ; also sheet 1
CONFIG0: R120.2 S6.13 ; also sheet 1
CONFIG1: R119.2 S6.14 ; also sheet 1
CONFIG2: R118.2 S6.15 ; also sheet 1
CONFIG3: R117.2 S6.16 ; also sheet 1
CONFIG4: R116.2 S6.17 ; also sheet 1
CONFIG5: R115.2 S6.18 ; also sheet 1
CONFIG6: R114.2 S6.19 ; also sheet 1
CONFIG7: R113.2 S6.20 ; also sheet 1
CONFIG8: R112.2 S6.21 ; also sheet 1
CONFIG9: R111.2 S6.22 ; also sheet 1
CONFIG10: R110.2 S6.23 ; also sheet 1
CONFIG11: R109.2 S6.24 ; also sheet 1
ENABLEINT: R80.2 S4.8 ; also sheet 1
EXN: JP1.3 ; also sheet 1
EXP: JP1.2 ; also sheet 1
GND: C55.2 C56.2 C57.2 C58.2 C59.2 C60.2 H1.B5,5(MOUNT) H2.B5,5(MOUNT) H3.B5,5(MOUNT) H4.B5,5(MOUNT) H5.B5,5(MOUNT) JP1.1 R73.1 R74.1 R75.1 R76.1 R77.1 R78.1 R79.1 R80.1 R81.1 R101.2 R103.1 R104.1 R106.1 R107.1 R108.1 R109.1 R110.1 R111.1 R112.1 R113.1 R114.1 R115.1 R116.1 R117.1 R118.1 R119.1 R120.1 R121.1 R122.1 R123.1 R124.1 R125.1 R126.1 ; also sheet 1,2,3,5
GND_PULLDOWN: JP3.1 JP3.2 ; also sheet 1
IBIAS_ARRAY: C55.1 C56.1 R130.A ; also sheet 1
IBIAS_FLDCAS: C57.1 C58.1 R131.A ; also sheet 1
IBIAS_FOLL: C59.1 C60.1 R132.A ; also sheet 1
LINK: JP1.4 ; also sheet 1
LINK_CORE: R81.2 S4.9 ; also sheet 1
N$7: JP2.25
N$29: R127.1 R130.S TP1.TP
N$43: R128.1 R131.S TP2.TP
N$52: R129.1 R132.S TP3.TP
OFFSET0: R73.2 S4.1 ; also sheet 1
OFFSET1: R74.2 S4.2 ; also sheet 1
OFFSET2: R75.2 S4.3 ; also sheet 1
OFFSET3: R76.2 S4.4 ; also sheet 1
OFFSET4: R77.2 S4.5 ; also sheet 1
OFFSET5: R78.2 S4.6 ; also sheet 1
OFFSET6: R79.2 S4.7 ; also sheet 1
OR: R106.2 S7.6 ; also sheet 1
OR_SIMPLE: R107.2 S7.5 ; also sheet 1
RESET: R101.1 S2.B ; also sheet 1
VCMREF: JP1.7 ; also sheet 1
Unconnected: R130.E R131.E R132.E S2.A' S2.B'

## Sheet 5 of 5
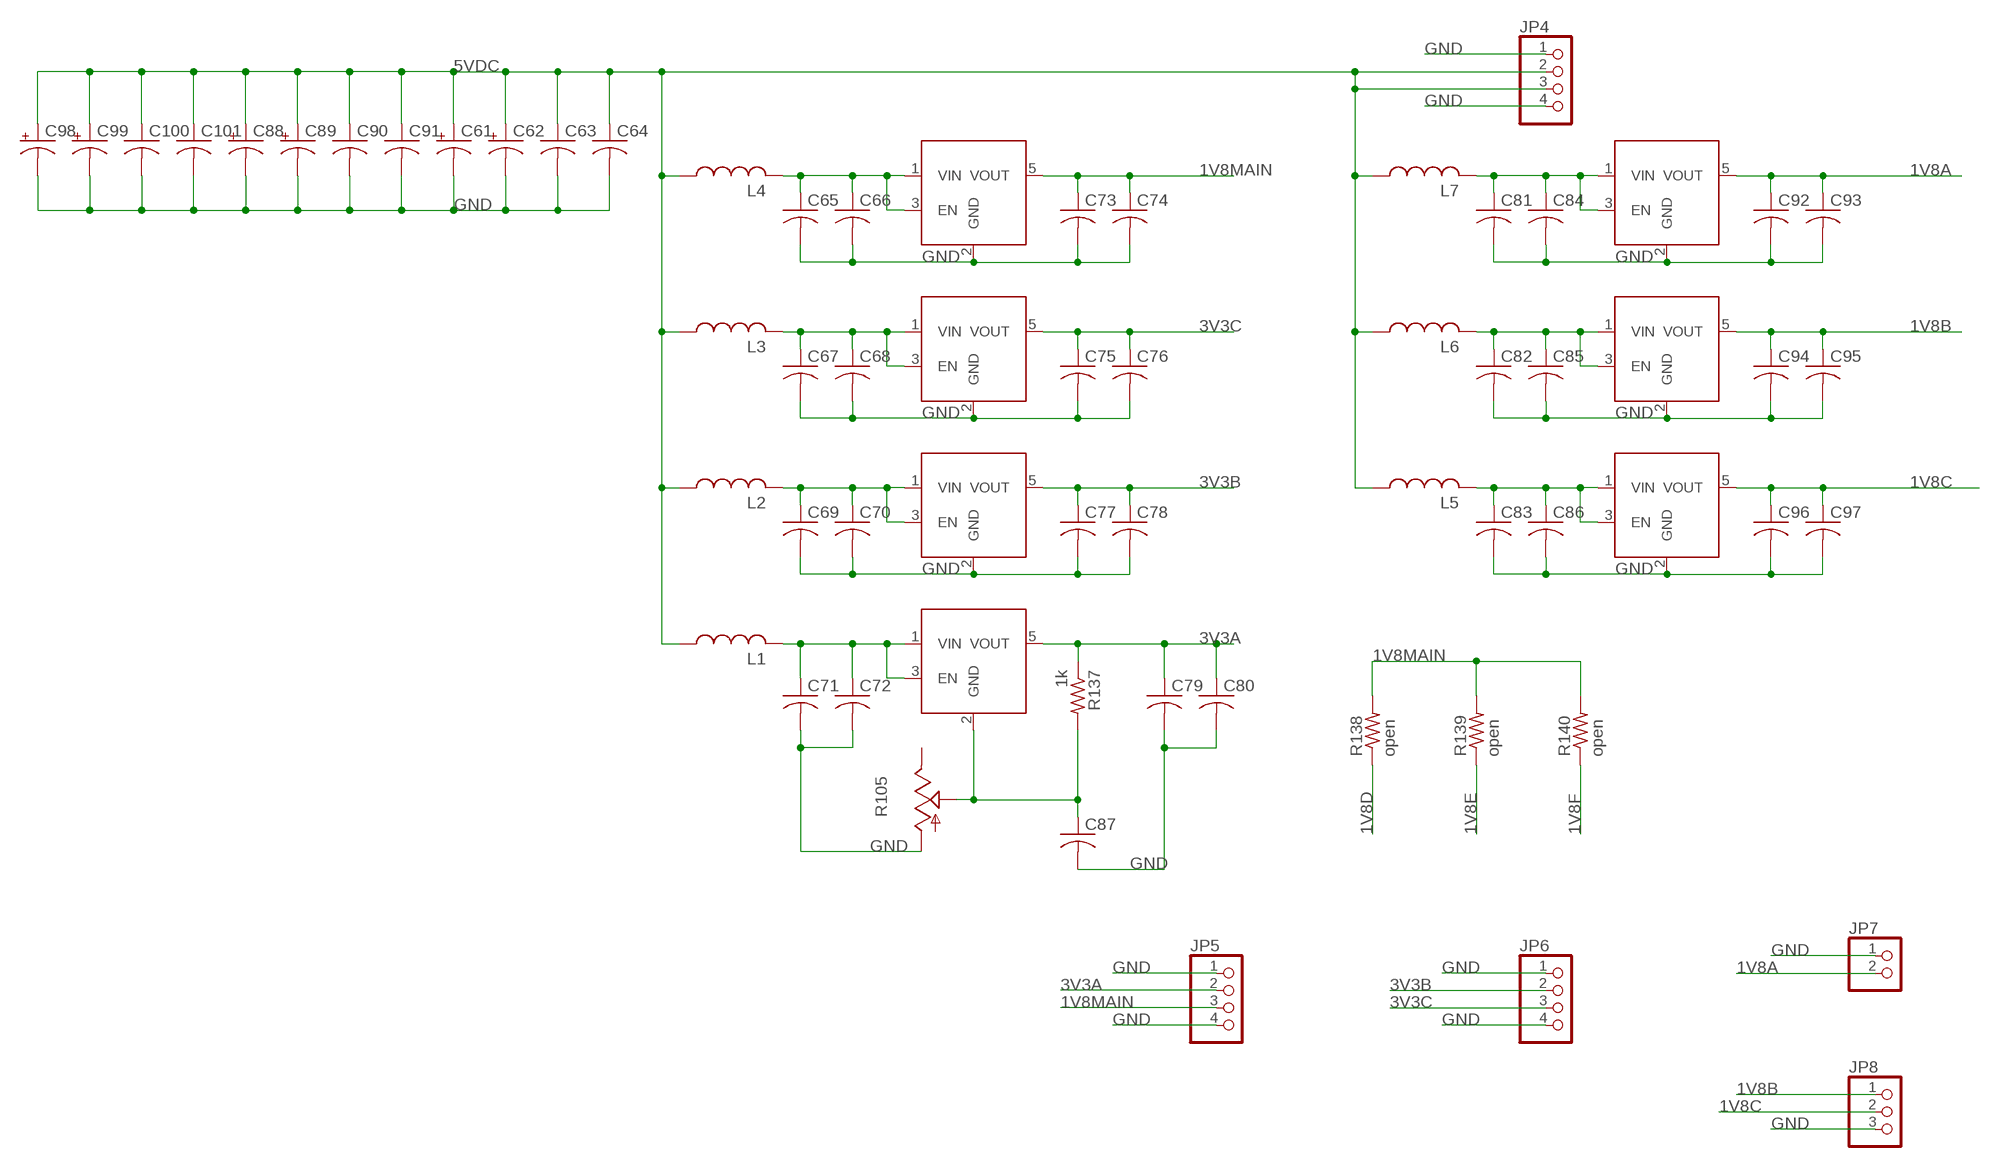
[diagram p5: schematic, sheet 5]

### Parts
C61  CPOL-USE/7260-38R  [E/7260-38R]
C62  CPOL-USE/7260-38R  [E/7260-38R]
C63  C-USC1210  [C1210]
C64  C-USC1210  [C1210]
C65  C-USC0603  [C0603]
C66  C-USC1210  [C1210]
C67  C-USC0603  [C0603]
C68  C-USC1210  [C1210]
C69  C-USC0603  [C0603]
C70  C-USC1210  [C1210]
C71  C-USC0603  [C0603]
C72  C-USC1210  [C1210]
C73  C-USC1210  [C1210]
C74  C-USC0603  [C0603]
C75  C-USC1210  [C1210]
C76  C-USC0603  [C0603]
C77  C-USC1210  [C1210]
C78  C-USC0603  [C0603]
C79  C-USC1210  [C1210]
C80  C-USC0603  [C0603]
C81  C-USC0603  [C0603]
C82  C-USC0603  [C0603]
C83  C-USC0603  [C0603]
C84  C-USC1210  [C1210]
C85  C-USC1210  [C1210]
C86  C-USC1210  [C1210]
C87  C-USC0603  [C0603]
C88  CPOL-USE/7260-38R  [E/7260-38R]
C89  CPOL-USE/7260-38R  [E/7260-38R]
C90  C-USC1210  [C1210]
C91  C-USC1210  [C1210]
C92  C-USC1210  [C1210]
C93  C-USC0603  [C0603]
C94  C-USC1210  [C1210]
C95  C-USC0603  [C0603]
C96  C-USC1210  [C1210]
C97  C-USC0603  [C0603]
C98  CPOL-USE/7260-38R  [E/7260-38R]
C99  CPOL-USE/7260-38R  [E/7260-38R]
C100  C-USC1210  [C1210]
C101  C-USC1210  [C1210]
JP4  PINHD-1X4  [1X04]
JP5  PINHD-1X4  [1X04]
JP6  PINHD-1X4  [1X04]
JP7  PINHD-1X2  [1X02]
JP8  PINHD-1X3  [1X03]
L1  L-USL1812  [L1812]
L2  L-USL1812  [L1812]
L3  L-USL1812  [L1812]
L4  L-USL1812  [L1812]
L5  L-USL1812  [L1812]
L6  L-USL1812  [L1812]
L7  L-USL1812  [L1812]
R105  TRIM_US-B64Y  [B64Y]
R137  1k  R-US_R0603  [R0603]
R138  open  R-US_R1206  [R1206]
R139  open  R-US_R1206  [R1206]
R140  open  R-US_R1206  [R1206]
U$13  ADP151  [TSOT23-5]
U$14  ADP151  [TSOT23-5]
U$15  ADP151  [TSOT23-5]
U$28  ADP151  [TSOT23-5]
U$29  ADP151  [TSOT23-5]
U$30  ADP151  [TSOT23-5]
U$31  ADP151  [TSOT23-5]

### Nets
1V8A: C92.1 C93.1 JP7.2 U$13.5(VOUT) ; also sheet 1,4
1V8B: C94.1 C95.1 JP8.1 U$14.5(VOUT) ; also sheet 1,4
1V8C: C96.1 C97.1 JP8.2 U$15.5(VOUT) ; also sheet 1,4
1V8D: R138.1 ; also sheet 1
1V8E: R139.1 ; also sheet 1
1V8F: R140.1 ; also sheet 1
1V8MAIN: C73.1 C74.1 JP5.3 R138.2 R139.2 R140.2 U$28.5(VOUT) ; also sheet 4
3V3A: C79.1 C80.1 JP5.2 R137.1 U$31.5(VOUT) ; also sheet 1
3V3B: C77.1 C78.1 JP6.2 U$30.5(VOUT) ; also sheet 1
3V3C: C75.1 C76.1 JP6.3 U$29.5(VOUT) ; also sheet 1,3
5VDC: C61.+ C62.+ C63.1 C64.1 C88.+ C89.+ C90.1 C91.1 C98.+ C99.+ C100.1 C101.1 JP4.2 JP4.3 L1.1 L2.1 L3.1 L4.1 L5.1 L6.1 L7.1 ; also sheet 1,2
GND: C61.- C62.- C63.2 C64.2 C65.2 C66.2 C67.2 C68.2 C69.2 C70.2 C71.2 C72.2 C73.2 C74.2 C75.2 C76.2 C77.2 C78.2 C79.2 C80.2 C81.2 C82.2 C83.2 C84.2 C85.2 C86.2 C87.2 C88.- C89.- C90.2 C91.2 C92.2 C93.2 C94.2 C95.2 C96.2 C97.2 C98.- C99.- C100.2 C101.2 JP4.1 JP4.4 JP5.1 JP5.4 JP6.1 JP6.4 JP7.1 JP8.3 R105.A U$13.2(GND) U$14.2(GND) U$15.2(GND) U$28.2(GND) U$29.2(GND) U$30.2(GND) ; also sheet 1,2,3,4
N$3: C67.1 C68.1 L3.2 U$29.1(VIN) U$29.3(EN)
N$10: C65.1 C66.1 L4.2 U$28.1(VIN) U$28.3(EN)
N$13: C69.1 C70.1 L2.2 U$30.1(VIN) U$30.3(EN)
N$27: C71.1 C72.1 L1.2 U$31.1(VIN) U$31.3(EN)
N$40: C81.1 C84.1 L7.2 U$13.1(VIN) U$13.3(EN)
N$49: C82.1 C85.1 L6.2 U$14.1(VIN) U$14.3(EN)
N$55: C83.1 C86.1 L5.2 U$15.1(VIN) U$15.3(EN)
N$110: C87.1 R105.S R137.2 U$31.2(GND)
Unconnected: R105.E

## Library data of the parts
C1-C60 C63-C87 C90-C97 C100 C101 = rcl:C-US: CAPACITOR, American symbol
C61 C62 C88 C89 C98 C99 = rcl:CPOL-US: POLARIZED CAPACITOR, American symbol
H1-H5 = holes:MOUNT-PAD-ROUND: MOUNTING PAD, round
IC1-IC4 = ic-package:DIL16: Dual In Line / Socket
IC5 IC7 = 74xx-us:74*540: Octal BUFFER and LINE DRIVER, 3-state
IC6 = 74xx-us:74*74: Dual D type positive edge triggered FLIP FLOP, preset and clear
J1 J4 = CustomConn:AMPMODU50-80
J2 = CustomConn:AMPMODU50-60
J3 = CustomConn:AMPMODU50-100
JP1 = pinhead:PINHD-1X7: PIN HEADER
JP2 = pinhead:PINHD-2X13: PIN HEADER
JP3 JP7 = pinhead:PINHD-1X2: PIN HEADER
JP4-JP6 = pinhead:PINHD-1X4: PIN HEADER
JP8 = pinhead:PINHD-1X3: PIN HEADER
JP9 = pinhead:PINHD-1X30: PIN HEADER
L1-L7 = rcl:L-US: INDUCTOR, American symbol
LSP1 = testpad:TPS: TEST PIN
R1-R104 R106-R129 R133-R140 = rcl:R-US_: RESISTOR, American symbol
R105 R130-R132 = pot:TRIM_US-: POTENTIOMETER
S1 = switch-dil:219-02*: Surface Mount DIP Switch Series 219 SMT CTS Electronic Components Sourc: www.ctscorp.com
S2 = CustomPassive:EVQPA: Panasonic EVQPA tactile switch, 6.0mm x 6.0mm
S4 = switch-dil:219-09*: Surface Mount DIP Switch Series 219 SMT CTS Electronic Components Sourc: www.ctscorp.com
S5 = switch-dil:219-06*: Surface Mount DIP Switch Series 219 SMT CTS Electronic Components Sourc: www.ctscorp.com
S6 = switch-dil:219-12*: Surface Mount DIP Switch Series 219 SMT CTS Electronic Components Sourc: www.ctscorp.com
S7 = switch-dil:219-03*: Surface Mount DIP Switch Series 219 SMT CTS Electronic Components Sourc: www.ctscorp.com
TP1-TP3 = testpad:TP: Test pad
U$1-U$12 = CustomAnalog:AD823
U$13-U$15 U$28-U$31 = CustomAnalog:ADP151